# EAGLE design devboard-rf (EAGLE 6.1)
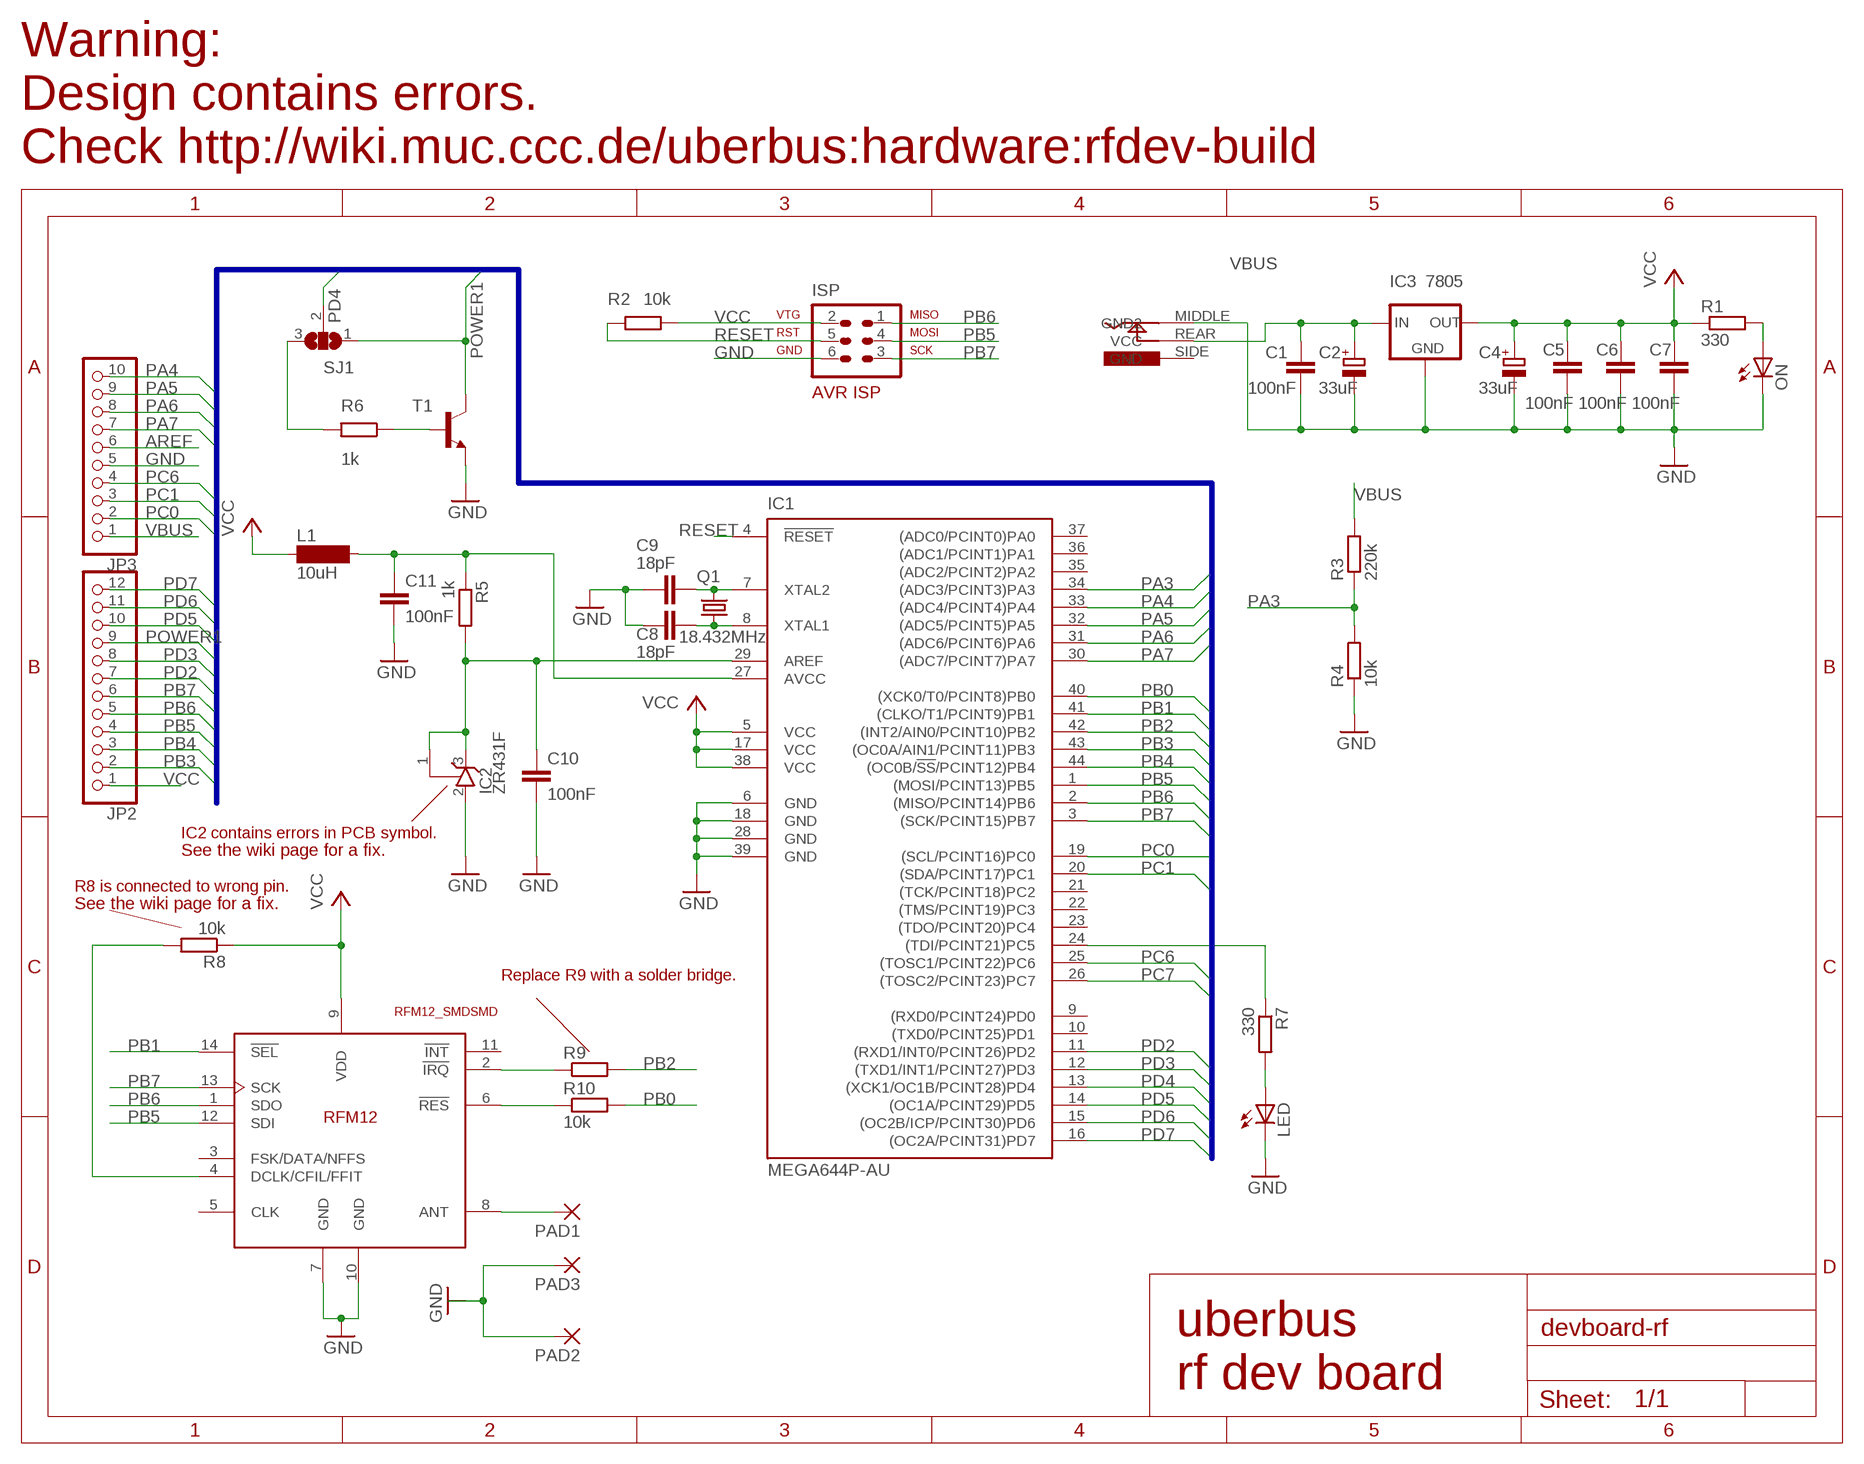
[diagram p0: schematic, sheet 1]

## Parts
C1  100nF  C-EUC0805K  [C0805K]
C2  33uF  CPOL-EUE2.5-5  [E2,5-5]
C4  33uF  CPOL-EUE2.5-5  [E2,5-5]
C5  100nF  C-EUC0805K  [C0805K]
C6  100nF  C-EUC0805K  [C0805K]
C7  100nF  C-EUC0805K  [C0805K]
C8  18pF  C-EUC0805K  [C0805K]
C9  18pF  C-EUC0805K  [C0805K]
C10  100nF  C-EUC0805K  [C0805K]
C11  100nF  C-EUC0805K  [C0805K]
IC1  MEGA644P-AU  MEGA164P/324P/644P-AU  [TQFP44]
IC2  ZR431F  [SOT32]
IC3  7805  78XXS  [78XXS]
ISP  AVR-ISP-6  [AVR-ISP-6]
JP2  PINHD-1X12  [1X12]
JP3  PINHD-1X10  [1X10]
L1  10uH  SM-1206  [SM-1206]
LED  LEDCHIPLED_0805  [CHIPLED_0805]
ON  LEDCHIPLED_0805  [CHIPLED_0805]
PAD1  SMD2  [SMD1,27-2,54]
PAD2  SMD2  [SMD1,27-2,54]
PAD3  SMD2  [SMD1,27-2,54]
Q1  18.432MHz  CRYSTALHC49UP  [HC49UP]
R1  330  R-EU_R0805  [R0805]
R2  10k  R-EU_R0805  [R0805]
R3  220k  R-EU_R0805  [R0805]
R4  10k  R-EU_R0805  [R0805]
R5  1k  R-EU_R0805  [R0805]
R6  1k  R-EU_R0805  [R0805]
R7  330  R-EU_R0805  [R0805]
R8  10k  R-EU_R0805  [R0805]
R9  0  R-EU_R0805  [R0805]
R10  10k  R-EU_R0805  [R0805]
SJ1  SJ2W  [SJ_2]
T1  MMBT2222ALT1-NPN-SOT23-BEC  [SOT23-BEC]
U$1  RFM12_SMDSMD  [RFM12]
U$2  JACK-2.1MM  [JACK-2.1MM]

## Nets
AREF: C10.1 IC1.29(AREF) IC2.1(R) IC2.3(C) JP3.6 R5.2
AVCC: C11.1 IC1.27(AVCC) L1.2 R5.1
GND: C1.1 C2.- C4.- C5.1 C6.1 C7.1 C8.2 C9.2 C10.2 C11.2 IC1.6(GND) IC1.18(GND) IC1.28(GND) IC1.39(GND) IC2.2(A) IC3.GND ISP.6 JP3.5 LED.C ON.C R4.1 T1.E U$1.7(GND) U$1.10(GND) U$2.MIDDLE(GND2)
N$1: C8.1 IC1.8(XTAL1) Q1.1
N$2: C9.1 IC1.7(XTAL2) Q1.2
N$3: LED.A R7.2
N$4: PAD2.1(P) PAD3.1(P)
N$6: R10.1 U$1.6(!RES)
N$7: R9.1 U$1.2(!IRQ)
N$12: R6.2 SJ1.3
N$18: PAD1.1(P) U$1.8(ANT)
N$19: R8.2 U$1.4(DCLK/CFIL/FFIT)
N$20: R6.1 T1.B
N$21: ON.A R1.2
N$22: IC1.24((TDI/PCINT21)PC5) R7.1
PA3: IC1.34((ADC3/PCINT3)PA3) R3.1 R4.2
PA4: IC1.33((ADC4/PCINT4)PA4) JP3.10
PA5: IC1.32((ADC5/PCINT5)PA5) JP3.9
PA6: IC1.31((ADC6/PCINT6)PA6) JP3.8
PA7: IC1.30((ADC7/PCINT7)PA7) JP3.7
PB0: IC1.40((XCK0/T0/PCINT8)PB0) R10.2
PB1: IC1.41((CLKO/T1/PCINT9)PB1) U$1.14(!SEL)
PB2: IC1.42((INT2/AIN0/PCINT10)PB2) R9.2
PB3: IC1.43((OC0A/AIN1/PCINT11)PB3) JP2.2
PB4: IC1.44((OC0B/!SS!/PCINT12)PB4) JP2.3
PB5: IC1.1((MOSI/PCINT13)PB5) ISP.4 JP2.4 U$1.12(SDI)
PB6: IC1.2((MISO/PCINT14)PB6) ISP.1 JP2.5 U$1.1(SDO)
PB7: IC1.3((SCK/PCINT15)PB7) ISP.3 JP2.6 U$1.13(SCK)
PC0: IC1.19((SCL/PCINT16)PC0) JP3.2
PC1: IC1.20((SDA/PCINT17)PC1) JP3.3
PC6: IC1.25((TOSC1/PCINT22)PC6) JP3.4
PC7: IC1.26((TOSC2/PCINT23)PC7)
PD2: IC1.11((RXD1/INT0/PCINT26)PD2) JP2.7
PD3: IC1.12((TXD1/INT1/PCINT27)PD3) JP2.8
PD4: IC1.13((XCK1/OC1B/PCINT28)PD4) SJ1.2
PD5: IC1.14((OC1A/PCINT29)PD5) JP2.10
PD6: IC1.15((OC2B/ICP/PCINT30)PD6) JP2.11
PD7: IC1.16((OC2A/PCINT31)PD7) JP2.12
POWER1: JP2.9 SJ1.1 T1.C
RESET: IC1.4(!RESET) ISP.5 R2.1
VBUS: C1.2 C2.+ IC3.IN JP3.1 R3.2 U$2.REAR(VCC)
VCC: C4.+ C5.2 C6.2 C7.2 IC1.5(VCC) IC1.17(VCC) IC1.38(VCC) IC3.OUT ISP.2 JP2.1 L1.1 R1.1 R2.2 R8.1 U$1.9(VDD)
Unconnected: IC1.9((RXD0/PCINT24)PD0) IC1.10((TXD0/PCINT25)PD1) IC1.21((TCK/PCINT18)PC2) IC1.22((TMS/PCINT19)PC3) IC1.23((TDO/PCINT20)PC4) IC1.35((ADC2/PCINT2)PA2) IC1.36((ADC1/PCINT1)PA1) IC1.37((ADC0/PCINT0)PA0) U$1.3(FSK/DATA/NFFS) U$1.5(CLK) U$1.11(!INT) U$2.SIDE(GND)

## Buses
PA[0..7],PB[0..7],PC[0..7],PD[0..7],POWER1,POWER2

## Notes on the sheet
- Warning:
- Design contains errors.
- Check http://wiki.muc.ccc.de/uberbus:hardware:rfdev-build
- IC2 contains errors in PCB symbol.
- See the wiki page for a fix.
- R8 is connected to wrong pin.
- See the wiki page for a fix.
- Replace R9 with a solder bridge.
- uberbus
- rf dev board

## Library data of the parts
C1 C5-C11 = rcl:C-EU: CAPACITOR, European symbol
C2 C4 = rcl:CPOL-EU: POLARIZED CAPACITOR, European symbol
IC1 = avr-6:MEGA164P/324P/644P-AU
IC2 = zr431:ZR431F
IC3 = v-reg:78XXS: VOLTAGE REGULATOR
ISP = avr-6:AVR-ISP-6: AVR ISP-6 Serial Programming Header
JP2 = pinhead:PINHD-1X12: PIN HEADER
JP3 = pinhead:PINHD-1X10: PIN HEADER
L1 = inductor-neosid:SM-1206: INDUCTOR SMD chip inductor
LED ON = led:LED: LED OSRAM: - CHIPLED LG R971, LG N971, LY N971, LG Q971, LY Q971, LO R971, LY R971 LH N974, LH R974 LS Q976, LO Q976, LY Q976 LO Q996 - Hyper CHIPLED LW Q18S LB Q993, LB Q99A, LB R99A - SideLED LS A670, LO A670, LY A670, LG A670, LP A670 LB A673, LV A673, LT A673, LW A673 LH A674 LY A675 LS A676, LA A676, LO A676, LY A676, LW A676 LS A679, LY A679, LG A679 - Hyper Micro SIDELED® LS Y876, LA Y876, LO Y876, LY Y876 LT Y87S - SmartLED LW L88C, LW L88S LB L89C, LB L89S, LG L890 LS L89K, LO L89K, LY L89K LS L896, LA L896, LO L896, LY L896 - TOPLED LS T670, LO T670, LY T670, LG T670, LP T670 LSG T670, LSP T670, LSY T670, LOP T670, LYG T670 LG T671, LOG T671, LSG T671 LB T673, LV T673, LT T673, LW T673 LH T674 LS T676, LA T676, LO T676, LY T676, LB T676, LH T676, LSB T676, LW T676 LB T67C, LV T67C, LT T67C, LS T67K, LO T67K, LY T67K, LW E67C LS E67B, LA E67B, LO E67B, LY E67B, LB E67C, LV E67C, LT E67C LW T67C LS T679, LY T679, LG T679 LS T770, LO T770, LY T770, LG T770, LP T770 LB T773, LV T773, LT T773, LW T773 LH T774 LS E675, LA E675, LY E675, LS T675 LS T776, LA T776, LO T776, LY T776, LB T776 LHGB T686 LT T68C, LB T68C - Hyper Mini TOPLED® LB M676 - Mini TOPLED Santana® LG M470 LS M47K, LO M47K, LY M47K Source: http://www.osram.convergy.de LUXEON: - LUMILED® LXK2-PW12-R00, LXK2-PW12-S00, LXK2-PW14-U00, LXK2-PW14-V00 LXK2-PM12-R00, LXK2-PM12-S00, LXK2-PM14-U00 LXK2-PE12-Q00, LXK2-PE12-R00, LXK2-PE12-S00, LXK2-PE14-T00, LXK2-PE14-U00 LXK2-PB12-K00, LXK2-PB12-L00, LXK2-PB12-M00, LXK2-PB14-N00, LXK2-PB14-P00, LXK2-PB14-Q00 LXK2-PR12-L00, LXK2-PR12-M00, LXK2-PR14-Q00, LXK2-PR14-R00 LXK2-PD12-Q00, LXK2-PD12-R00, LXK2-PD12-S00 LXK2-PH12-R00, LXK2-PH12-S00 LXK2-PL12-P00, LXK2-PL12-Q00, LXK2-PL12-R00 Source: www.luxeon.com KINGBRIGHT: KA-3528ASYC Source: www.kingbright.com
PAD1-PAD3 = wirepad:SMD2: SMD PAD
Q1 = crystal:CRYSTAL: CRYSTAL
R1-R10 = rcl:R-EU_: RESISTOR, European symbol
SJ1 = jumper:SJ2W: SMD solder JUMPER
T1 = transistor:*-NPN-: NPN Transistror BF959 corrected 2008.03.06
U$1 = rfm_12:RFM12_SMD: RFM12 is a low costing ISM band transceiver module implemented with unique PLL. It works signal ranges from 315/433/868/915MHZ bands, comply with FCC, ETSI regulation. The SPI interface is used to communicate with microcontroller for parameter setting.
U$2 = theremin:JACK-2.1MM

## Board
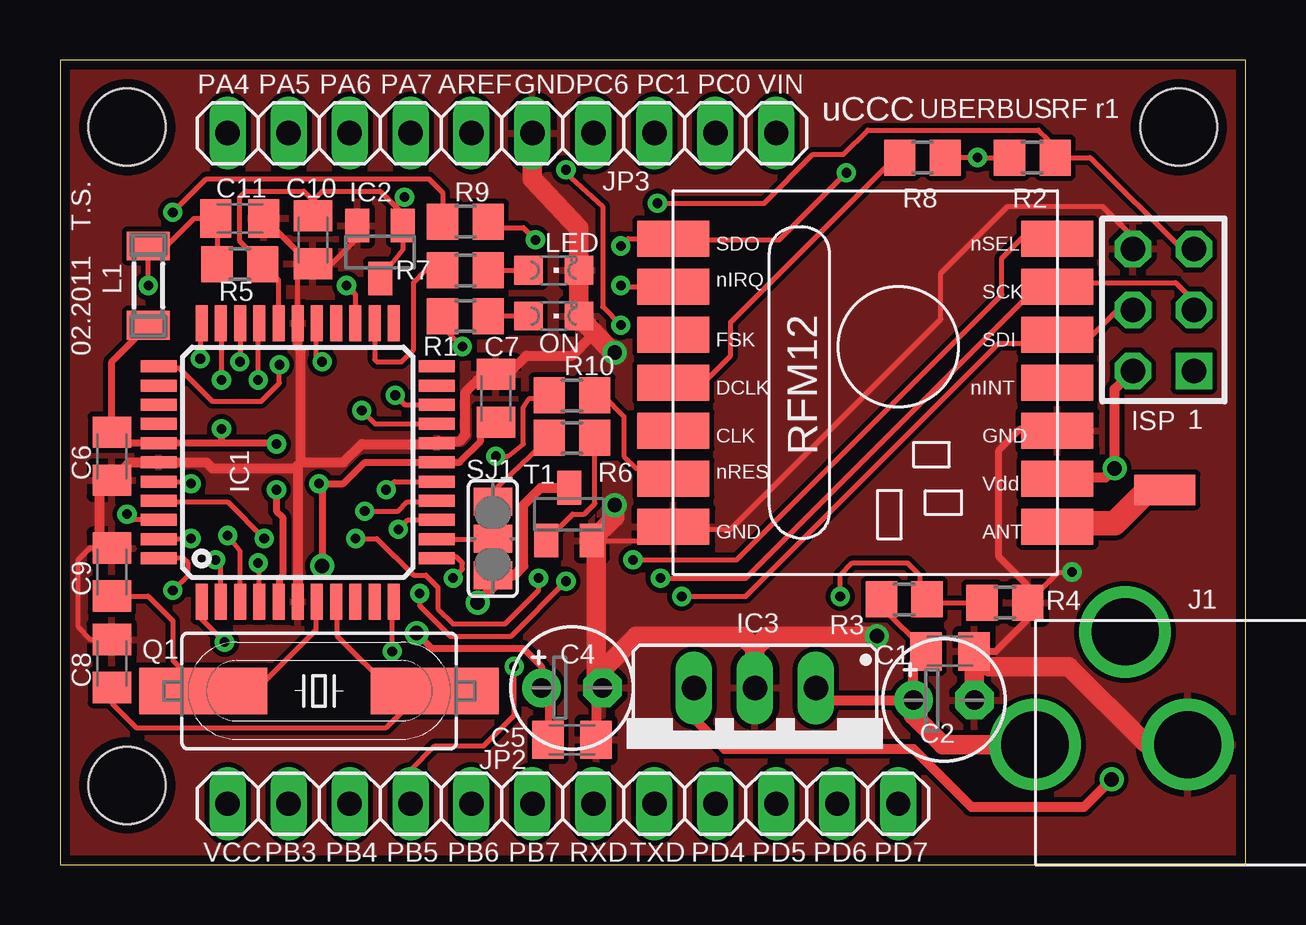
[diagram p1: board, top side]
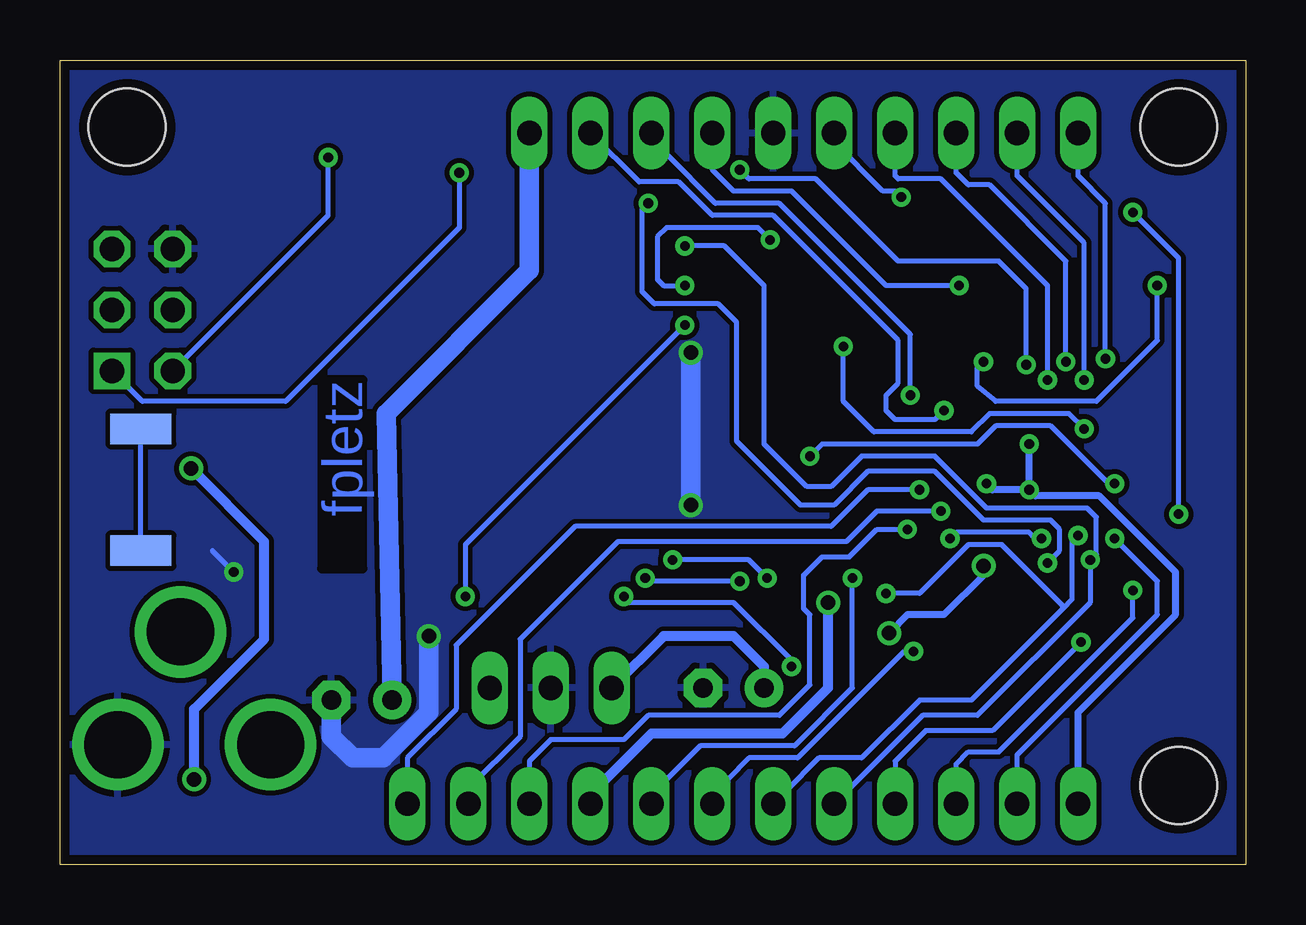
[diagram p2: board, bottom side, seen from below]

Size 49.4 x 33.53 mm. Coordinates in mm from the lower left corner, seen from the top.
Outline: 0,0 49.4,0 49.4,33.53 0,33.53 0,0
Copper layers (1*16): Top 0.035mm / dielectric 1.5mm / Bottom 0.035mm
Design rules: minimum track width 0.2mm, minimum drill 0.4mm, track to track 8mil, track to pad 8mil, pad to pad 8mil, via to via 8mil, smd to smd 2mil, copper to edge 0.4mm, drill to drill 8mil, minimum pad ring 10mil, minimum via ring 0.2mm, stop-mask expansion 2mil, vias tented up to drill 0mil, thermal gap 10mil
Holes 3.2 mm at 2.79,3.3 2.79,30.73 46.61,30.73

### Footprints (pad centres in the part's own frame; a part is rotated, then mirrored left to right if it is on the bottom)
C0805K = smd 1.3 x 1.6: 1 -1,0; 2 1,0
E2,5-5 = drill 0.813 pad 1.6: + -1.27,0 | drill 0.813 pad 1.6 octagon: - 1.27,0
TQFP44 = smd 1.5 x 0.5: 1 -5.8,4; 2 -5.8,3.2; 3 -5.8,2.4; 4 -5.8,1.6; 5 -5.8,0.8; 6 -5.8,0; 7 -5.8,-0.8; 8 -5.8,-1.6; 9 -5.8,-2.4; 10 -5.8,-3.2; 11 -5.8,-4; 23 5.8,-4; 24 5.8,-3.2; 25 5.8,-2.4; 26 5.8,-1.6; 27 5.8,-0.8; 28 5.8,0; 29 5.8,0.8; 30 5.8,1.6; 31 5.8,2.4; 32 5.8,3.2; 33 5.8,4 | smd 0.5 x 1.5: 12 -4,-5.8; 13 -3.2,-5.8; 14 -2.4,-5.8; 15 -1.6,-5.8; 16 -0.8,-5.8; 17 0,-5.8; 18 0.8,-5.8; 19 1.6,-5.8; 20 2.4,-5.8; 21 3.2,-5.8; 22 4,-5.8; 34 4,5.8; 35 3.2,5.8; 36 2.4,5.8; 37 1.6,5.8; 38 0.8,5.8; 39 0,5.8; 40 -0.8,5.8; 41 -1.6,5.8; 42 -2.4,5.8; 43 -3.2,5.8; 44 -4,5.8
SOT32 = smd 1 x 1.4: 1 -0.95,-1.1; 2 0.95,-1.1; 3 0,1.1
78XXS = drill 1.016 long: GND 0,-2.54; IN -2.54,-2.54; OUT 2.54,-2.54
AVR-ISP-6 = drill 1.016 square: 1 -2.54,-1.27 | drill 1.016 octagon: 2 -2.54,1.27; 3 0,-1.27; 4 0,1.27; 5 2.54,-1.27; 6 2.54,1.27
1X12 = drill 1.016 long: 1 -13.97,0; 2 -11.43,0; 3 -8.89,0; 4 -6.35,0; 5 -3.81,0; 6 -1.27,0; 7 1.27,0; 8 3.81,0; 9 6.35,0; 10 8.89,0; 11 11.43,0; 12 13.97,0
1X10 = drill 1.016 long: 1 -11.43,0; 2 -8.89,0; 3 -6.35,0; 4 -3.81,0; 5 -1.27,0; 6 1.27,0; 7 3.81,0; 8 6.35,0; 9 8.89,0; 10 11.43,0
SM-1206 = smd 1.2 x 1.8: 1 -1.65,0; 2 1.65,0
CHIPLED_0805 = smd 1.2 x 1.2: A 0,-1.05; C 0,1.05
SMD1,27-2,54 = smd 1.27 x 2.54: 1 0,0
HC49UP = smd 5.334 x 1.93: 1 -4.826,0; 2 4.826,0
R0805 = smd 1.3 x 1.5: 1 -0.95,0; 2 0.95,0
SJ_2 = smd 1.168 x 1.6: 1 -1.524,0; 2 0,0; 3 1.524,0
SOT23-BEC = smd 1 x 1.4: B -0.95,-1.1; C 0,1.1; E 0.95,-1.1
RFM12 = smd 1.5 x 3: 1 -5,-10; 2 -3,-10; 3 -1,-10; 4 1,-10; 5 3,-10; 6 5,-10; 7 7,-10; 8 7,6; 9 5,6; 10 3,6; 11 1,6; 12 -1,6; 13 -3,6; 14 -5,6
JACK-2.1MM = drill 2.8: MIDDLE -2.541,0.08; REAR 3.824,0.08; SIDE 0.07,-4.62

### Placement (x,y rotation side)
C1  37.08,8.89 180 top
C2  36.83,6.86 0 top
C4  21.34,7.37 0 top
C5  21.34,5.21 180 top
C6  2.16,17.02 90 top
C7  18.16,19.43 270 top
C8  2.16,8.38 90 top
C9  2.16,12.19 90 top
C10  10.54,26.04 270 top
C11  7.49,26.92 0 top
IC1  9.91,16.76 90 top
IC2  13.34,25.53 180 top
IC3  28.96,4.83 180 top
ISP  45.97,23.11 90 top
JP2  20.95,2.54 0 top
JP3  18.41,30.48 180 top
L1  3.68,24.13 90 top
LED  20.57,24.77 270 top
ON  20.57,22.86 270 top
PAD1  46.04,15.62 90 top
PAD2  46.04,13.08 270 bottom
PAD3  46.04,18.16 90 bottom
Q1  10.79,7.24 180 top
R1  16.89,22.86 0 top
R2  40.51,29.46 180 top
R3  35.18,11.05 180 top
R4  39.37,10.92 180 top
R5  7.49,25.02 0 top
R6  21.34,17.78 180 top
R7  16.89,24.77 0 top
R8  35.94,29.46 180 top
R9  16.89,26.8 180 top
R10  21.34,19.56 180 top
SJ1  18.03,13.59 90 top
T1  21.21,14.61 0 top
U$1  35.56,21.08 270 top
U$2  44.45,5.08 180 top

### Tracks (layer width: path | path; a pad name or v marks a point on that pad's centre or on a via)
AREF  (via drill 0.4)
  Top 0.2: IC2.3 14.29,25.63 IC2.1 | IC2.1 14.35,26.95 | IC1.29 9.11,24.36 R5.2 7.49,25.97 7.49,27.81 7.75,28.07 10.16,28.07 10.54,27.69 | IC2.1 14.29,27.12 13.97,27.43 | 10.54,27.69 C10.1 | 10.54,27.69 10.92,28.07 13.34,28.07 13.97,27.43 | 13.97,27.43 v14.35,27.81
  Bottom 0.2: JP3.6 17.14,30.1 15.11,28.07 14.61,28.07 v14.35,27.81
AVCC  (via drill 0.4)
  Top 0.2: v3.68,24.13 L1.2 4.44,25.78 5.59,26.92 C11.1 6.54,26.87 R5.1 | IC1.27 10.67,22.53 10.67,21.21 v10.92,20.95
  Bottom 0.2: v3.68,24.13 3.68,21.84 6.22,19.3 10.41,19.3 11.18,19.94 11.18,20.7 v10.92,20.95
GND  (via drill 0.4, 0.6)
  Top 0.2: 11.32,25.04 12.32,26.04 12.32,26.82 IC2.2 | 8.65,26.92 C11.2 | IC1.28 9.91,24.4 | C8.2 1.29,9.38 0.76,9.91 0.76,12.7 1.27,13.21 2.14,13.21 | 2.14,13.21 C9.2 | 2.14,16 C6.1 1.65,15.51 | 15.67,17.53 IC1.18 15.79,17.65 | 9.91,16.76 9.91,16.64 10.03,16.76 | 21.97,22.57 ON.C 22.1,22.7 22.1,21.97 | 17.64,20.43 C7.1 18.65,20.43 | 22.14,13.51 T1.E | T1.E 24.98,13.51 U$1.7 25.67,13.97 27.94,13.97 36.7,22.73 36.7,24.64 39.5,27.43 43.43,27.43 44.7,26.16 ISP.6 | 40.26,10.16 40.26,10.86 R4.1 | R4.1 40.26,10.98 | T1.E 22.21,13.46 | 2.14,13.21 2.14,13.22 1.65,13.72 | 41.48,18.16 U$1.10 | R4.1 41.59,12.19 v42.16,12.19
  Top 0.254: 8.65,26.92 8.65,26.78 10.4,25.04 C10.2
  Top 0.3: C1.1 38.99,8.89 40.26,10.16 | 40.26,10.98 40.26,11.68 39.12,12.83 39.12,17.27 40.01,18.16 41.48,18.16
  Top 0.406: C6.1 2.9,16.76 IC1.39 6.1,16.76 6.35,16.51 9.91,16.51 | 9.91,16.51 IC1.6 | 9.91,16.51 9.91,16.64 | 17.64,20.43 16.89,19.68 16.89,17.91 16.64,17.65 15.79,17.65 | U$1.10 41.51,18.03 | 15.67,17.53 12.57,17.53 11.81,16.76 10.16,16.76 | 10.03,16.76 10.16,16.76 | 18.65,20.43 19.43,21.21 21.34,21.21 22.1,21.97 | 38.35,8.62 C1.1 38.72,8.26 | C5.1 22.34,7.22 22.35,7.24 22.48,7.37 C4.- 22.61,8.13 | 1.65,13.72 1.65,15.51 | T1.E 22.35,13.31 | 23.02,21.34 v23.11,21.34 | C2.- 38.08,6.87 | IC1.28 9.91,21.59 10.03,21.46 10.03,16.89 10.16,16.76
  Top 0.813: 28.96,9.02 29.46,9.53 v34.04,9.53 | 28.96,9.02 IC3.GND | 45.21,5.08 42.04,8.26 38.72,8.26 | 28.96,9.02 28.45,9.53 24,9.53 22.61,8.13 | JP3.5 19.68,28.57 21.62,26.51 LED.C ON.C 23.02,21.34 | 22.35,13.31 22.35,7.24 | 38.08,6.87 C1.1 | 22.14,13.51 23.11,14.48 v23.11,14.99
  Bottom 0.2: v42.16,12.19 43.05,13.08
  Bottom 0.813: v34.04,9.53 34.04,6.35 35.94,4.45 37.21,4.45 38.1,5.33 C2.- | v23.11,21.34 v23.11,14.99
  pour Bottom: -1.91,34.8 -1.91,-0.89 56.64,-0.89 56.64,34.8
  pour Top: -1.91,34.8 -1.91,-0.89 56.64,-0.89 56.64,34.8
N$1
  Top 0.2: 15.11,7.24 Q1.1 | 15.11,7.24 13.84,7.24 11.56,9.53 11.56,10.91 IC1.8 | C8.1 2.16,6.73 3.17,5.71 13.59,5.71 15.11,7.24
N$2
  Top 0.2: IC1.7 10.67,10.93 10.67,9.78 8.13,7.24 Q1.2 4.7,8.51 4.7,10.16 3.67,11.19 C9.1
N$3
  Top 0.2: R7.2 LED.A
N$4
  Bottom 0.2: PAD3.1 PAD2.1 45.97,13.02
N$6
  Top 0.2: U$1.6 25.13,16.51 24,16.51 23.5,17.02 23.5,18.67 22.61,19.56 R10.1
N$7  (via drill 0.4)
  Top 0.2: U$1.2 23.54,24.08 v23.37,24.13 | R9.1 18.09,26.54 19.3,26.54 v19.81,26.04
  Bottom 0.2: v19.81,26.04 20.32,26.54 24.13,26.54 24.51,26.16 24.51,24.38 24.26,24.13 v23.37,24.13
N$12
  Top 0.2: SJ1.3 18.03,15.55 R6.2
N$18
  Top 0.2: U$1.8 41.7,14.22 | 45.34,15.62 PAD1.1
  Top 1.016: 41.7,14.22 43.94,14.22 45.34,15.62
N$19
  Top 0.2: R8.2 35.05,29.4 34.74,29.4 27.94,22.61 27.94,21.21 26.81,20.08 U$1.4
N$20
  Top 0.2: T1.B 21.36,14.61 21.84,14.61 22.29,15.05 R6.1
N$21
  Top 0.2: ON.A R1.2
N$22
  Top 0.2: 15.62,24.77 R7.1 15.24,24.77 14.73,24.26 14.73,21.46 14.22,20.95 13.21,20.95 13.11,21.06 IC1.24
PA3  (via drill 0.4)
  Top 0.2: R4.2 36.26,10.92 R3.1 35.81,11.36 35.81,12.06 35.31,12.57 33.02,12.57 32.51,12.06 v32.51,11.18 | IC1.34 4.17,20.7 4.95,20.7 6.35,19.3 8.38,19.3 9.14,20.07 v9.14,20.83 | v23.37,22.48 22.61,23.24 22.61,27.43 21.08,28.83 v21.08,28.96
  Bottom 0.2: v9.14,20.83 9.14,24 10.29,25.15 14.48,25.15 17.91,28.57 20.7,28.57 v21.08,28.96 | v32.51,11.18 32.51,13.34 v23.37,22.48
PA4  (via drill 0.4)
  Top 0.2: IC1.33 5.84,22.5 v5.84,21.08
  Bottom 0.2: v5.84,21.08 5.84,27.56 6.99,28.7 JP3.10
PA5  (via drill 0.4)
  Top 0.2: IC1.32 6.73,22.54 v6.73,20.19
  Bottom 0.2: v6.73,20.19 6.73,25.91 9.53,28.7 JP3.9
PA6  (via drill 0.4)
  Top 0.2: IC1.31 7.51,20.97 v7.49,20.95
  Bottom 0.2: v7.49,20.95 7.49,25.15 10.67,28.32 11.56,28.32 12.06,28.83 JP3.8
PA7  (via drill 0.4)
  Top 0.2: IC1.30 8.26,22.51 v8.26,20.19
  Bottom 0.2: v8.26,20.19 8.26,24.13 12.7,28.57 14.48,28.57 14.61,28.7 JP3.7
PB0  (via drill 0.4)
  Top 0.2: R10.2 20.13,19.43 19.56,19.43 19.3,19.05 19.3,17.53 18.67,17.02 v18.16,17.02 | v5.46,15.88 5.37,15.96 IC1.40
  Bottom 0.2: v18.16,17.02 17.65,17.53 11.18,17.53 10.41,18.29 8.13,18.29 5.71,15.88 v5.46,15.88
PB1  (via drill 0.4)
  Top 0.2: U$1.14 40.05,26.08 39.24,25.27 39.24,23.75 28.19,12.7 v23.88,12.7 | IC1.41 4.16,15.11 6.99,15.11 v8.51,13.59 | v12.32,13.59 13.21,13.59 14.73,12.06 15.24,12.06 15.75,11.56 15.75,10.67 16.38,10.03 18.54,10.03 19.94,11.43 v19.94,11.94
  Bottom 0.2: v19.94,11.94 20.7,12.7 v23.88,12.7 | v8.51,13.59 8.76,13.59 9.02,13.84 12.06,13.84 v12.32,13.59
PB2  (via drill 0.4)
  Top 0.2: IC1.42 3.04,14.36 v2.79,14.61 | v4.7,27.18 6.1,28.57 15.37,28.57 15.94,28 R9.2
  Bottom 0.2: v2.79,14.61 2.79,25.27 v4.7,27.18
PB3  (via drill 0.4)
  Top 0.2: IC1.43 5.56,13.56 v5.46,13.59
  Bottom 0.2: JP2.2 9.53,4.57 3.68,10.41 3.68,11.81 v5.46,13.59
PB4  (via drill 0.4)
  Top 0.2: IC1.44 5.14,12.76 5.33,12.57 5.33,12.06 v4.7,11.43
  Bottom 0.2: v4.7,11.43 4.7,10.29 10.29,4.7 11.56,4.7 12.06,4.19 JP2.3
PB5  (via drill 0.4)
  Top 0.2: IC1.1 5.91,10.22 v6.86,9.27 | ISP.4 44.07,23.11 43.05,22.1 41.58,22.1 U$1.12 41.2,21.72 39.12,21.72 28.57,11.18 v25.91,11.18 | JP2.4 14.61,3.94 15.62,4.95 17.65,4.95 18.92,6.22 v18.92,8.26
  Bottom 0.2: v6.86,9.27 10.54,5.59 13.34,5.59 14.61,4.32 JP2.4 | 18.92,8 v18.92,8.26 18.92,8.51 21.34,10.92 25.65,10.92 v25.91,11.18
PB6  (via drill 0.4)
  Top 0.2: IC1.2 6.71,12.68 v6.48,12.7 | v32.77,28.83 29.97,26.04 25.61,26.04 U$1.1 23.67,26.08 v23.37,25.78
  Bottom 0.2: ISP.1 45.97,19.3 40.01,19.3 32.77,26.54 v32.77,28.83 | v6.48,12.7 6.35,12.7 | v6.48,12.7 6.22,12.95 6.22,14.48 6.6,14.86 10.79,14.86 12.95,17.02 16,17.02 17.27,15.75 18.29,15.75 20.07,17.53 20.07,24.13 21.72,25.78 v23.37,25.78 | JP2.5 13.46,6.22 11.18,6.22 6.48,10.92 v6.48,12.7
PB7  (via drill 0.4)
  Top 0.2: ISP.3 47.24,23.5 46.48,24.26 41.73,24.26 U$1.13 41.23,23.75 40.39,23.75 28.57,11.94 v25.02,11.94 | IC1.3 7.51,13.07 v6.99,13.72 | v14.99,11.3 14.99,10.79 16.26,9.53 18.8,9.53 v21.08,11.81
  Bottom 0.2: 19.68,3.05 19.68,3.3 | 19.68,3.05 JP2.6 | v25.02,11.94 24.89,11.94 24.77,11.81 v21.08,11.81 | v6.99,13.72 7.24,13.46 7.24,11.05 7.62,10.67 | 7.62,10.67 11.43,6.86 13.59,6.86 16,4.45 17.78,4.45 19.18,3.05 19.68,3.05 | 7.62,10.67 7.62,10.79 10.16,13.34 11.56,13.34 13.59,11.3 v14.99,11.3
PC0  (via drill 0.4)
  Top 0.2: IC1.19 13.13,18.36 v12.57,18.92
  Bottom 0.2: JP3.2 25.27,28.45 23.62,28.45 22.23,27.05 19.68,27.05 14.48,21.84 14.48,20.07 14.99,19.56 14.99,18.92 14.61,18.54 12.95,18.54 v12.57,18.92
PC1  (via drill 0.4)
  Top 0.2: IC1.20 14.36,19.16 v13.97,19.56
  Bottom 0.2: v13.97,19.56 13.97,22.1 19.43,27.56 22.1,27.56 24.13,29.59 24.13,29.84 JP3.3
PC6  (via drill 0.4)
  Top 0.2: IC1.25 12.32,22.58 12.32,23.75 v11.94,24.13
  Bottom 0.2: 22.23,29.21 JP3.4 22.23,28.96 21.34,28.07 18.92,28.07 14.99,24.13 v11.94,24.13
PD2  (via drill 0.4)
  Top 0.2: IC1.11 13.84,10.9 v13.84,8.89
  Bottom 0.2: JP2.7 21.59,3.17 21.59,3.56 20.7,4.45 18.67,4.45 14.22,8.89 v13.84,8.89
PD3  (via drill 0.4)
  Top 0.2: v16.38,11.94 16.76,12.32 16.76,12.57 16.51,12.83 15.77,12.83 IC1.12
  Bottom 0.2: JP2.8 24.77,2.92 22.73,4.95 18.8,4.95 16.38,7.37 v16.38,11.94
PD4
  Top 0.2: IC1.13 18.01,13.56 SJ1.2
PD5  (via drill 0.4 pad 0.61)
  Top 0.2: IC1.14 14.49,14.36 v14.1,13.97
  Bottom 0.2: JP2.10 29.84,4.32 28.96,5.21 25.91,5.21 24.89,6.22 19.43,6.22 18.16,7.49 18.16,10.41 18.41,10.67 18.41,12.06 17.65,12.83 16.51,12.83 15.37,13.97 v14.1,13.97
PD6  (via drill 0.4)
  Top 0.2: v12.7,14.73 14.1,14.73 14.48,15.11 15.65,15.11 IC1.15
  Bottom 0.2: 32.26,2.67 JP2.11 32.38,3.17 30.23,5.33 30.23,9.4 26.16,13.46 16.64,13.46 15.37,14.73 v12.7,14.73
PD7  (via drill 0.4)
  Top 0.2: IC1.16 13.93,15.96 v13.59,15.62
  Bottom 0.2: JP2.12 34.92,4.45 32.89,6.48 32.89,9.14 27.94,14.1 17.27,14.1 15.75,15.62 v13.59,15.62
POWER1  (via drill 0.6)
  Top 0.406: T1.C 20.02,15.71 19.3,14.99 19.3,12.45 18.92,12.06 SJ1.1 18.03,11.56 v17.4,10.92
  Bottom 0.406: JP2.9 27.3,2.92 24.77,5.46 19.3,5.46 17.4,7.37 v17.4,10.92
RESET  (via drill 0.4)
  Top 0.2: ISP.5 46.74,25.65 42.93,29.46 R2.1 41.15,29.52 41.15,30.23 40.77,30.61 33.66,30.61 32.64,29.59 31.37,29.59 29.34,27.56 v24.89,27.56 | IC1.4 8.31,12.52 v8.26,12.57
  Bottom 0.2: 8.26,12.7 v8.26,12.57 7.75,13.08 7.75,13.97 8.13,14.35 10.92,14.35 12.95,16.38 15.75,16.38 17.14,14.99 18.54,14.99 21.21,17.65 21.21,22.61 21.97,23.37 24.64,23.37 25.15,23.88 25.15,27.3 v24.89,27.56
VBUS
  Top 0.2: 35.94,8.89 C1.2 34.23,10.74 R3.2
  Top 0.406: C1.2 35.56,8.37 C2.+ 32,6.86 IC3.IN
  Top 0.813: U$2.REAR 36.78,5 35.56,6.22 C2.+
  Bottom 0.813: C2.+ 35.81,18.8 29.84,24.77 JP3.1
VCC  (via drill 0.4, 0.6, 0.6 pad 0.61)
  Top 0.2: v9.02,17.53 9.11,17.56 | 9.14,11 IC1.5 | 17.53,17.92 C7.2 | 41.61,16.13 U$1.9 | R2.2 v38.23,29.46 R8.1 | R1.1 15.94,22.41 v16.76,21.59
  Top 0.3: 9.11,17.56 6.73,17.56 | 6.73,17.56 IC1.38 2.61,17.56 C6.2 2.16,20.96 L1.1 | 17.53,17.92 17.53,17.65 16.64,16.76 IC1.17 12.7,16.76 11.81,15.88 v10.79,15.88 10.92,15.75 v10.92,12.45 | 9.14,11 9.14,11.94 9.27,12.06 9.27,14.48 9.02,14.73 v9.02,15.62 | 6.73,17.56 v6.73,18.16 | C5.2 20.34,7.1 C4.+ 20.07,8.26 19.3,9.02 15.49,9.02 v14.86,9.65
  Top 0.406: IC3.OUT 26.42,6.1 27.69,4.83 35.56,4.83 37.97,2.41 42.67,2.41 v43.81,3.56 | 41.61,16.13 43.56,16.13 v43.94,16.51 43.94,19.81 ISP.2
  Bottom 0.2: ISP.2 38.23,27.05 v38.23,29.46 | v16.76,21.59 16.76,19.3 15.49,18.03 11.43,18.03 10.67,18.8 7.37,18.8 v6.73,18.16
  Bottom 0.3: v9.02,15.62 v9.02,17.53 | v14.86,9.65 14.1,10.41 12.57,10.41 10.92,12.06 v10.92,12.45 | v10.79,15.88 10.54,15.62 v9.02,15.62 | v9.02,15.62 8.76,15.37 6.1,15.37 2.92,12.19 2.92,10.41 6.99,6.35 JP2.1
  Bottom 0.406: IC3.OUT 24.26,9.53 21.34,9.53 20.07,8.26 C4.+ | v43.81,3.56 43.81,6.48 40.89,9.4 40.89,13.46 v43.94,16.51

### Text on the board
Bottom: fpletz
tPlace: PA4 | PA5 | PA6 | PA7 | AREF | GND | PC6 | PC1 | PC0 | VIN | uCCC | UBERBUS | RF r1 | T.S. | 02.2011 | 1 | J1 | VCC | PB3 | PB4 | PB5 | PB6 | PB7 | RXD | TXD | PD4 | PD5 | PD6 | PD7